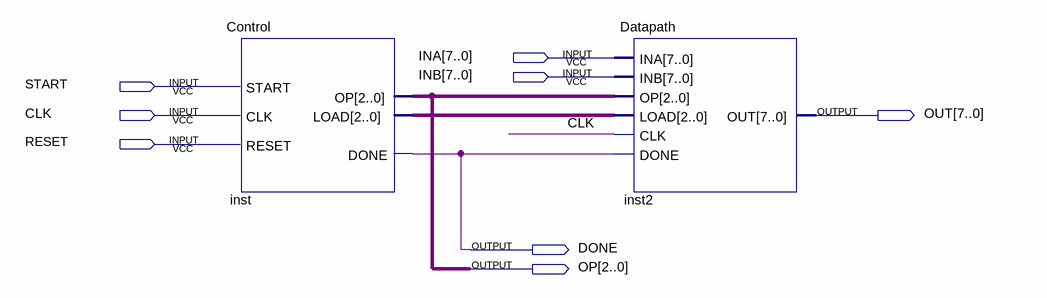
[diagram p0: schematic sheet]
// Quartus schematic chapter3.bdf as structural Verilog: 2 symbols, 8 pins
module chapter3 (
  input  [7:0] INA,
  input  [7:0] INB,
  input  START,
  input  CLK,
  input  RESET,
  output [7:0] OUT,
  output DONE,
  output [2:0] OP
);

  wire [2:0] inst_load;

  Control inst (.START(START), .CLK(CLK), .RESET(RESET), .LOAD(inst_load), .DONE(DONE), .OP(OP));
  Datapath inst2 (.INA(INA), .INB(INB), .OP(OP), .LOAD(inst_load), .CLK(CLK), .DONE(DONE), .OUT(OUT));
endmodule
